# EAGLE design sem1a-vcf (EAGLE 6.6.0)
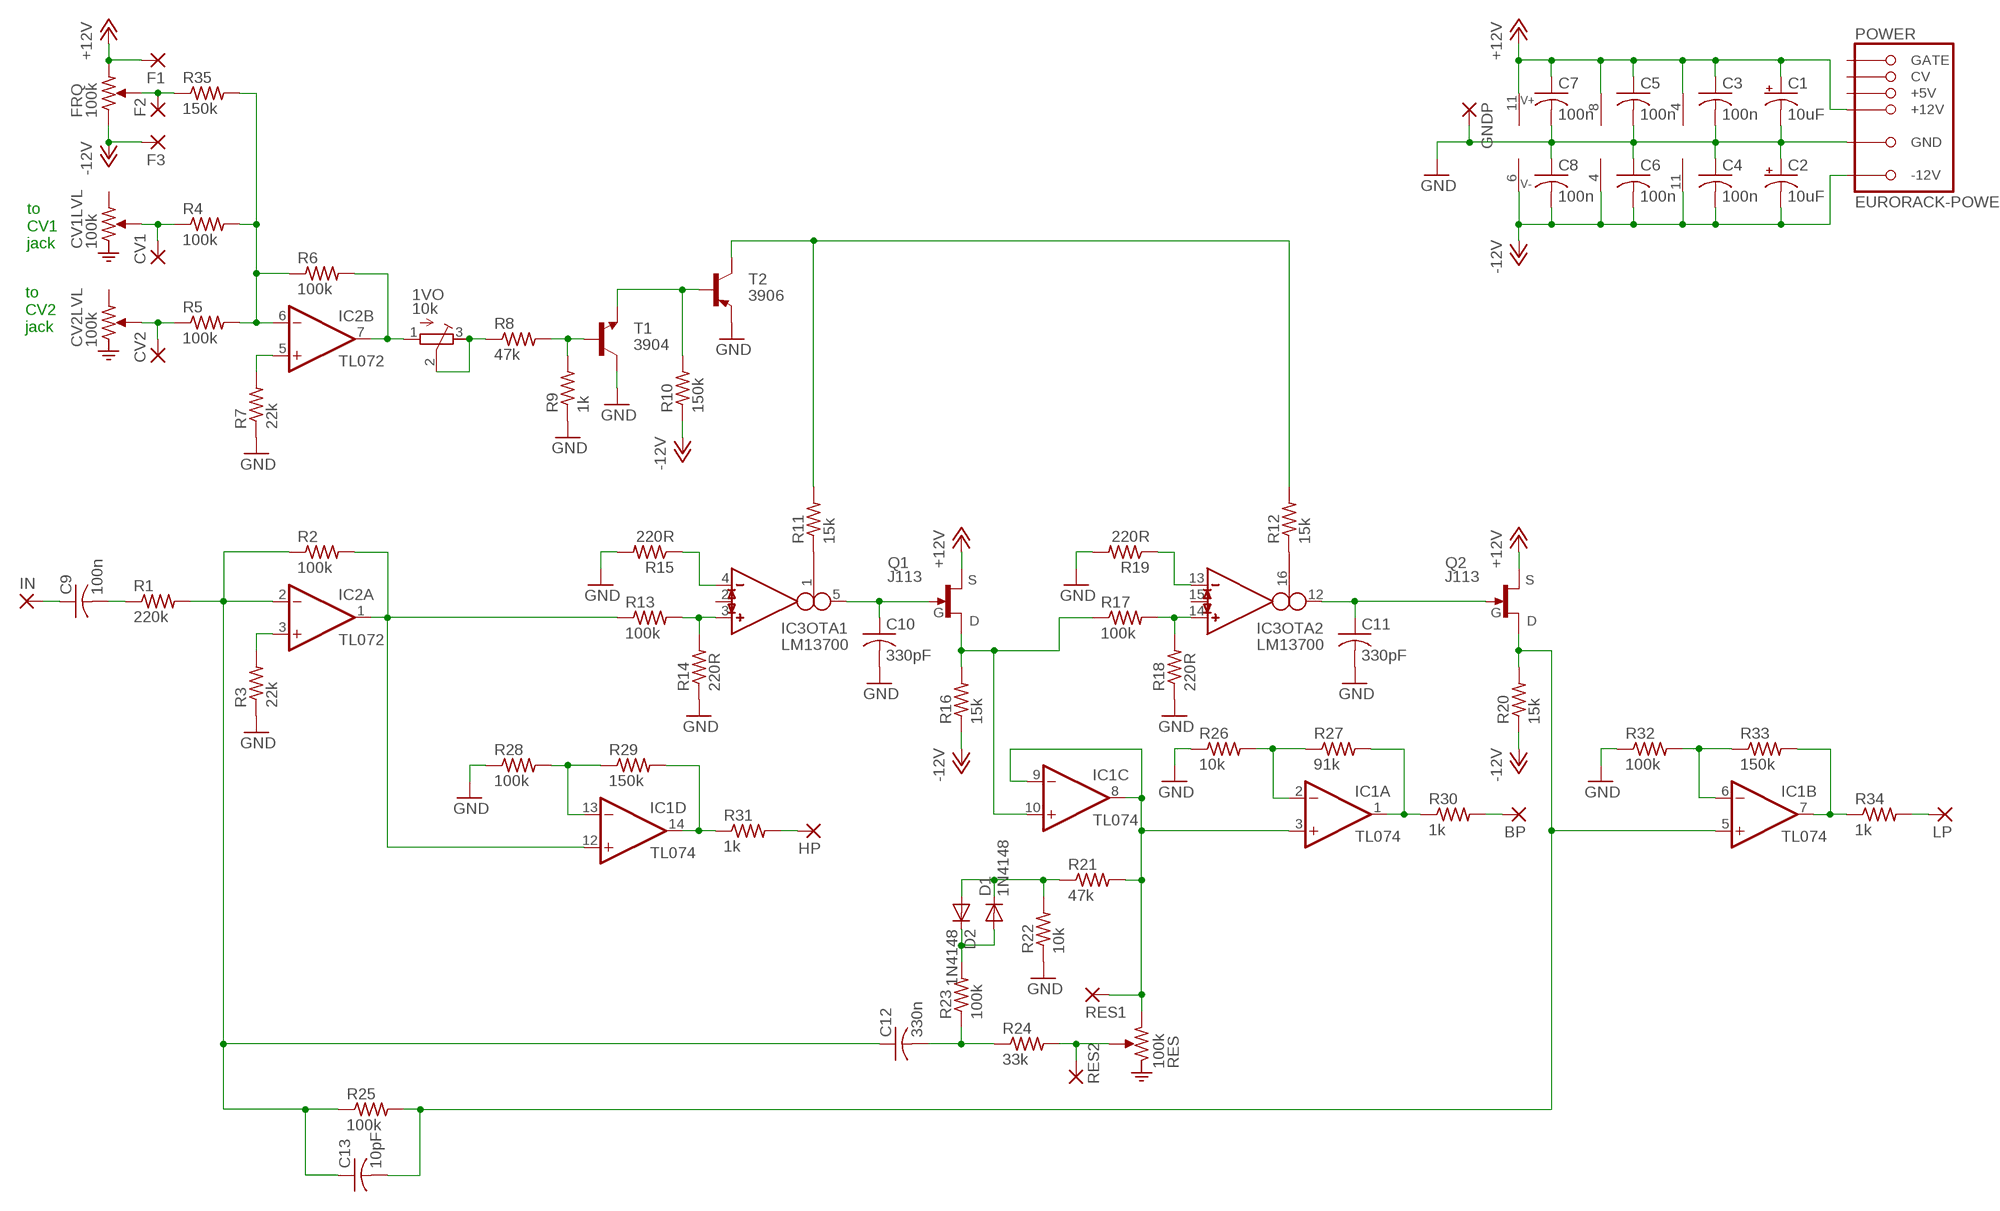
[diagram p0: schematic, sheet 1]

## Parts
1VO  10k  R-TRIMM64W  [RTRIM64W]
BP  2,54/1,0  [2,54/1,0]
C1  10uF  CPOL-USE2.5-5  [E2,5-5]
C2  10uF  CPOL-USE2.5-5  [E2,5-5]
C3  100n  C-US025-025X050  [C025-025X050]
C4  100n  C-US025-025X050  [C025-025X050]
C5  100n  C-US025-025X050  [C025-025X050]
C6  100n  C-US025-025X050  [C025-025X050]
C7  100n  C-US025-025X050  [C025-025X050]
C8  100n  C-US025-025X050  [C025-025X050]
C9  100n  C-US050-025X075  [C050-025X075]
C10  330pF  C-US050-025X075  [C050-025X075]
C11  330pF  C-US050-025X075  [C050-025X075]
C12  330n  C-US050-025X075  [C050-025X075]
C13  10pF  C-US050-025X075  [C050-025X075]
CV1  2,54/1,0  [2,54/1,0]
CV1LVL  100k  POT-ATTEN  (no package)
CV2  2,54/1,0  [2,54/1,0]
CV2LVL  100k  POT-ATTEN  (no package)
D1  1N4148  1N4148DO35-7  [DO35-7]
D2  1N4148  1N4148DO35-7  [DO35-7]
F1  2,54/1,0  [2,54/1,0]
F2  2,54/1,0  [2,54/1,0]
F3  2,54/1,0  [2,54/1,0]
FRQ  100k  POT  (no package)
GNDP  2,54/1,0  [2,54/1,0]
HP  2,54/1,0  [2,54/1,0]
IC1  TL074  TL074-TOPP  [DIL14]
IC2  TL072  TL072-TOPP  [DIL08]
IC3  LM13700  LM13700-TOPDIP16  [DIL16]
IN  2,54/1,0  [2,54/1,0]
LP  2,54/1,0  [2,54/1,0]
POWER  EURORACK-POWER  [PINSHRD_PTH_2X8]
Q1  J113  2N5457  [TO92-EBC]
Q2  J113  2N5457  [TO92-EBC]
R1  220k  R-US_0207/10  [0207/10]
R2  100k  R-US_0207/2V  [0207/2V]
R3  22k  R-US_0207/10  [0207/10]
R4  100k  R-US_0207/10  [0207/10]
R5  100k  R-US_0207/10  [0207/10]
R6  100k  R-US_0207/2V  [0207/2V]
R7  22k  R-US_0207/10  [0207/10]
R8  47k  R-US_0207/10  [0207/10]
R9  1k  R-US_0207/10  [0207/10]
R10  150k  R-US_0207/10  [0207/10]
R11  15k  R-US_0207/10  [0207/10]
R12  15k  R-US_0207/10  [0207/10]
R13  100k  R-US_0207/10  [0207/10]
R14  220R  R-US_0207/10  [0207/10]
R15  220R  R-US_0207/10  [0207/10]
R16  15k  R-US_0207/10  [0207/10]
R17  100k  R-US_0207/10  [0207/10]
R18  220R  R-US_0207/10  [0207/10]
R19  220R  R-US_0207/10  [0207/10]
R20  15k  R-US_0207/10  [0207/10]
R21  47k  R-US_0207/10  [0207/10]
R22  10k  R-US_0207/10  [0207/10]
R23  100k  R-US_0207/10  [0207/10]
R24  33k  R-US_0207/10  [0207/10]
R25  100k  R-US_0207/10  [0207/10]
R26  10k  R-US_0207/10  [0207/10]
R27  91k  R-US_0207/2V  [0207/2V]
R28  100k  R-US_0207/10  [0207/10]
R29  150k  R-US_0207/2V  [0207/2V]
R30  1k  R-US_0207/10  [0207/10]
R31  1k  R-US_0207/10  [0207/10]
R32  100k  R-US_0207/10  [0207/10]
R33  150k  R-US_0207/2V  [0207/2V]
R34  1k  R-US_0207/10  [0207/10]
R35  150k  R-US_0207/10  [0207/10]
RES  100k  POT-ATTEN  (no package)
RES1  2,54/1,0  [2,54/1,0]
RES2  2,54/1,0  [2,54/1,0]
T1  3904  -NPN-TO92-EBC  [TO92-EBC]
T2  3906  -PNP-TO92-EBC  [TO92-EBC]

## Nets
+12V: C1.+ C3.1 C5.1 C7.1 F1.1(P) FRQ.1 IC1.4(P:V+) IC2.8(P:V+) IC3.11 POWER.+12V@1(+12V) POWER.+12V@2(+12V) Q1.E(S) Q2.E(S)
-12V: C2.- C4.2 C6.2 C8.2 F3.1(P) FRQ.3 IC1.11(P:V-) IC2.4(P:V-) IC3.6 POWER.-12V@1(-12V) POWER.-12V@2(-12V) R10.1 R16.1 R20.1
GND: C1.- C2.+ C3.2 C4.1 C5.2 C6.1 C7.2 C8.1 C10.2 C11.2 GNDP.1(P) POWER.GND@1(GND) POWER.GND@2(GND) POWER.GND@3(GND) POWER.GND@4(GND) POWER.GND@5(GND) POWER.GND@6(GND) R3.1 R7.1 R9.1 R14.1 R15.2 R18.1 R19.2 R22.1 R26.1 R28.1 R32.1 T1.C T2.E
N$1: CV1.1(P) CV1LVL.2 R4.1
N$2: CV2.1(P) CV2LVL.2 R5.1
N$3: IC2.6(B:-IN) R4.2 R5.2 R6.1 R35.2
N$4: 1VO.2(S) 1VO.3(E) R8.1
N$5: R10.2 T1.E T2.B
N$6: IC1.3(A:+IN) IC1.8(C:OUT) IC1.9(C:-IN) R21.2 RES1.1(P) RES.1
N$7: R24.2 RES2.1(P) RES.2
N$8: R8.2 R9.2 T1.B
N$9: IC3.1(OTA1:I_BIAS) R11.1
N$10: C9.1 IN.1(P)
N$11: C9.2 R1.1
N$12: C12.1 C13.1 IC2.2(A:-IN) R1.2 R2.1 R25.1
N$13: IC1.12(D:+IN) IC2.1(A:OUT) R2.2 R13.1
N$14: IC2.3(A:+IN) R3.2
N$15: IC3.16(OTA2:I_BIAS) R12.1
N$16: 1VO.1(A) IC2.7(B:OUT) R6.2
N$17: IC2.5(B:+IN) R7.2
N$18: IC3.3(OTA1:IN_P) R13.2 R14.2
N$19: IC3.4(OTA1:IN_N) R15.1
N$20: C10.1 IC3.5(OTA1:OUT) Q1.C(G)
N$21: IC1.10(C:+IN) Q1.B(D) R16.2 R17.1
N$22: IC3.13(OTA2:IN_N) R19.1
N$23: IC3.14(OTA2:IN_P) R17.2 R18.2
N$24: C11.1 IC3.12(OTA2:OUT) Q2.C(G)
N$25: IC1.2(A:-IN) R26.2 R27.1
N$26: D1.C D2.A R21.1 R22.2
N$27: D1.A D2.C R23.2
N$28: R11.2 R12.2 T2.C
N$29: C12.2 R23.1 R24.1
N$30: C13.2 IC1.5(B:+IN) Q2.B(D) R20.2 R25.2
N$31: IC1.1(A:OUT) R27.2 R30.1
N$32: IC1.13(D:-IN) R28.2 R29.1
N$33: IC1.14(D:OUT) R29.2 R31.1
N$34: BP.1(P) R30.2
N$35: HP.1(P) R31.2
N$36: IC1.6(B:-IN) R32.2 R33.1
N$37: IC1.7(B:OUT) R33.2 R34.1
N$38: LP.1(P) R34.2
N$39: F2.1(P) FRQ.2 R35.1
Unconnected: CV1LVL.1 CV2LVL.1 IC3.2(OTA1:I_DIODE) IC3.7(BUF1:B) IC3.8(BUF1:E) IC3.9(BUF2:E) IC3.10(BUF2:B) IC3.15(OTA2:I_DIODE) POWER.+5V@1(+5V) POWER.+5V@2(+5V) POWER.CV@1(CV) POWER.CV@2(CV) POWER.GATE@1(GATE) POWER.GATE@2(GATE)

## Notes on the sheet
- to
  CV1
  jack
- to
  CV2
  jack

## Library data of the parts
1VO = rcl:R-TRIMM: Trimm resistor
BP CV1 CV2 F1-F3 GNDP HP IN LP RES1 RES2 = wirepad:2,54/1,0: THROUGH-HOLE PAD
C1 C2 = rcl:CPOL-US: POLARIZED CAPACITOR, American symbol
C3-C13 = rcl:C-US: CAPACITOR, American symbol
CV1LVL CV2LVL RES = mmoretti:POT-ATTEN
D1 D2 = diode:1N4148: DIODE high speed (Philips)
FRQ = mmoretti:POT
IC1 = mmoretti:TL074-TOP: OP AMP
IC2 = mmoretti:TL072-TOP: OP AMP
IC3 = mmoretti:LM13700-TOP
POWER = mmoretti:EURORACK-POWER
Q1 Q2 = mmoretti:2N5457
R1-R35 = rcl:R-US_: RESISTOR, American symbol
T1 = transistor-neu-to92:*-NPN-: NPN Transistror
T2 = transistor-neu-to92:*-PNP-: PNP Transistror

## Board
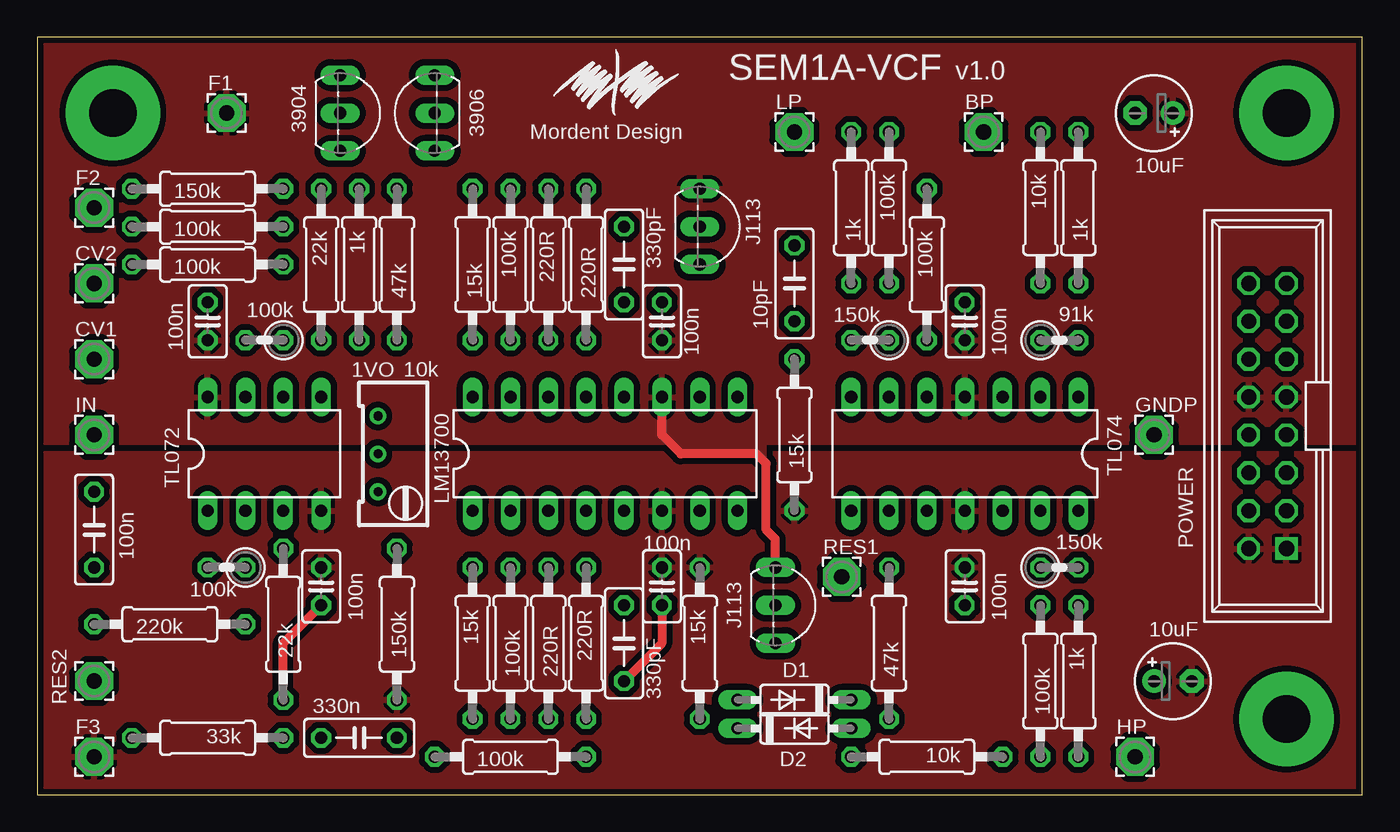
[diagram p1: board, top side]
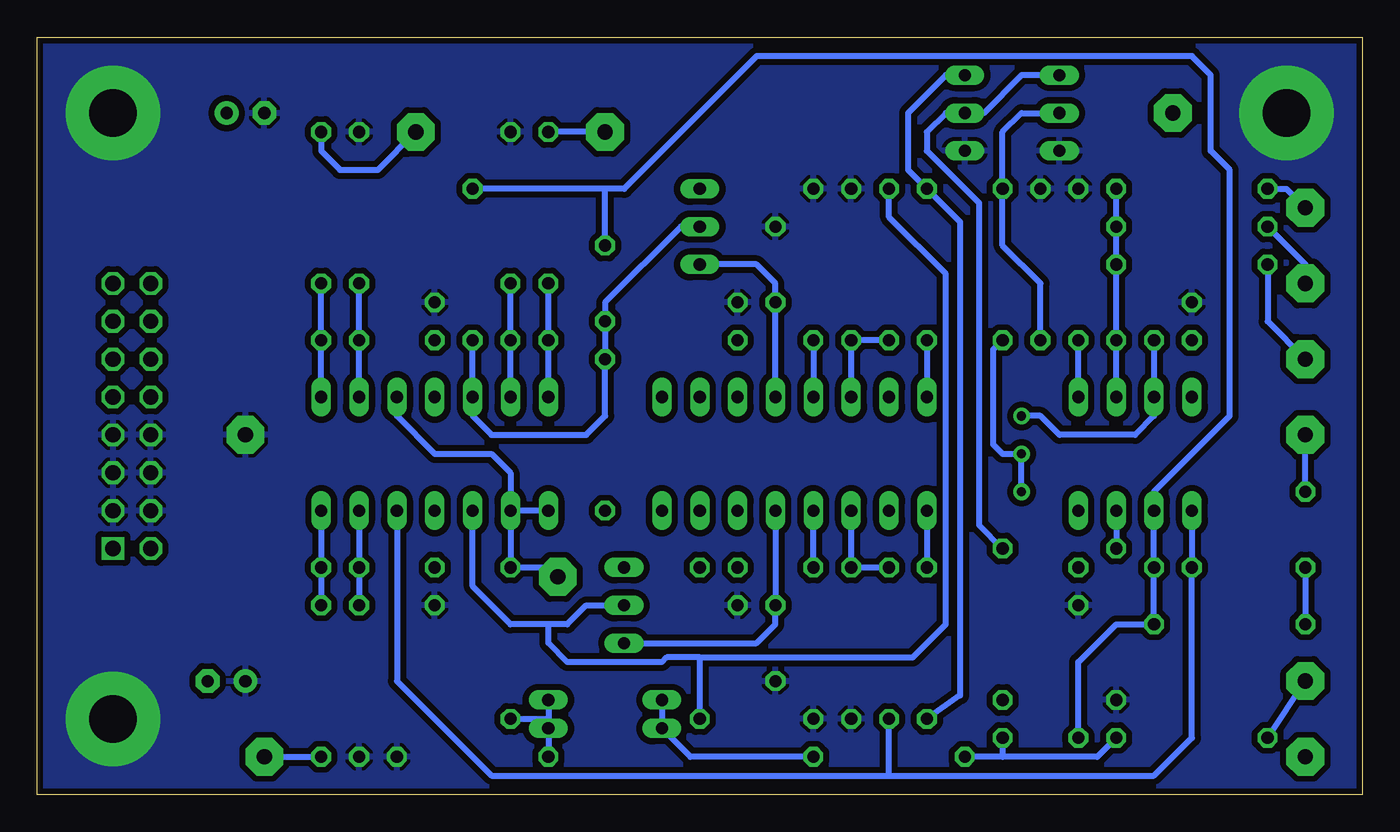
[diagram p2: board, bottom side, seen from below]

Size 88.9 x 50.8 mm. Coordinates in mm from the lower left corner, seen from the top.
Outline: 0,0 88.9,0 88.9,50.8 0,50.8 0,0
Copper layers (1*16): Top 0.035mm / dielectric 1.5mm / Bottom 0.035mm
Design rules "SeeedStudio_2layer_DRU_no_angle_20140221": minimum track width 6mil, minimum drill 12mil, track to track 6mil, track to pad 6mil, pad to pad 6mil, via to via 6mil, smd to smd 0mil, copper to edge 10mil, drill to drill 10mil, minimum pad ring 10mil, minimum via ring 6mil, stop-mask expansion 2mil, vias tented up to drill 100mil, thermal gap 10mil

### Footprints (pad centres in the part's own frame; a part is rotated, then mirrored left to right if it is on the bottom)
RTRIM64W = drill 0.61: 1 1.27,-2.54; 2 1.27,0; 3 1.27,2.54
2,54/1,0 = drill 1.016 pad 2.54 octagon: 1 0,0
E2,5-5 = drill 0.813 pad 1.6: + -1.27,0 | drill 0.813 pad 1.6 octagon: - 1.27,0
C025-025X050 = drill 0.813 octagon: 1 -1.27,0; 2 1.27,0
C050-025X075 = drill 0.813 octagon: 1 -2.54,0; 2 2.54,0
DO35-7 = drill 0.813 long: A 3.81,0; C -3.81,0
DIL14 = drill 0.813 long: 1 -7.62,-3.81; 2 -5.08,-3.81; 3 -2.54,-3.81; 4 0,-3.81; 5 2.54,-3.81; 6 5.08,-3.81; 7 7.62,-3.81; 8 7.62,3.81; 9 5.08,3.81; 10 2.54,3.81; 11 0,3.81; 12 -2.54,3.81; 13 -5.08,3.81; 14 -7.62,3.81
DIL08 = drill 0.813 long: 1 -3.81,-3.81; 2 -1.27,-3.81; 3 1.27,-3.81; 4 3.81,-3.81; 5 3.81,3.81; 6 1.27,3.81; 7 -1.27,3.81; 8 -3.81,3.81
DIL16 = drill 0.813 long: 1 -8.89,-3.81; 2 -6.35,-3.81; 3 -3.81,-3.81; 4 -1.27,-3.81; 5 1.27,-3.81; 6 3.81,-3.81; 7 6.35,-3.81; 8 8.89,-3.81; 9 8.89,3.81; 10 6.35,3.81; 11 3.81,3.81; 12 1.27,3.81; 13 -1.27,3.81; 14 -3.81,3.81; 15 -6.35,3.81; 16 -8.89,3.81
PINSHRD_PTH_2X8 = drill 1.016 octagon: +5V@1 3.81,1.27; +5V@2 3.81,-1.27; +12V@1 1.27,1.27; +12V@2 1.27,-1.27; -12V@1 -8.89,1.27; CV@1 6.35,1.27; CV@2 6.35,-1.27; GATE@1 8.89,1.27; GATE@2 8.89,-1.27; GND@1 -6.35,1.27; GND@2 -6.35,-1.27; GND@3 -3.81,1.27; GND@4 -3.81,-1.27; GND@5 -1.27,1.27; GND@6 -1.27,-1.27 | drill 1.016 square: -12V@2 -8.89,-1.27
TO92-EBC = drill 0.813 long: B 0,-1.27; C 2.54,-1.27; E -2.54,-1.27
0207/10 = drill 0.813 octagon: 1 -5.08,0; 2 5.08,0
0207/2V = drill 0.813 octagon: 1 -1.27,0; 2 1.27,0

### Placement (x,y rotation side)
1VO  24.13,22.86 180 top
BP  63.5,44.45 0 top
C1  74.93,45.72 180 top
C2  76.2,7.62 0 top
C3  62.23,31.75 90 top
C4  62.23,13.97 90 top
C5  41.91,31.75 90 top
C6  41.91,13.97 90 top
C7  11.43,31.75 90 top
C8  19.05,13.97 90 top
C9  3.81,17.78 270 top
C10  39.37,10.16 270 top
C11  39.37,35.56 90 top
C12  21.59,3.81 0 top
C13  50.8,34.29 270 top
CV1  3.81,29.21 0 top
CV2  3.81,34.29 0 top
D1  50.8,6.35 180 top
D2  50.8,4.45 0 top
F1  12.7,45.72 0 top
F2  3.81,39.37 0 top
F3  3.81,2.54 0 top
GNDP  74.93,24.13 0 top
HP  73.66,2.54 0 top
IC1  62.23,22.86 180 top
IC2  15.24,22.86 0 top
IC3  38.1,22.86 0 top
IN  3.81,24.13 0 top
LP  50.8,44.45 0 top
POWER  82.55,25.4 90 top
Q1  50.8,12.7 270 top
Q2  45.72,38.1 270 top
R1  8.89,11.43 0 top
R2  12.7,15.24 180 top
R3  16.51,11.43 90 top
R4  11.43,35.56 0 top
R5  11.43,38.1 0 top
R6  15.24,30.48 180 top
R7  19.05,35.56 270 top
R8  24.13,35.56 90 top
R9  21.59,35.56 270 top
R10  24.13,11.43 90 top
R11  29.21,10.16 270 top
R12  29.21,35.56 90 top
R13  31.75,10.16 90 top
R14  34.29,10.16 90 top
R15  36.83,10.16 270 top
R16  44.45,10.16 270 top
R17  31.75,35.56 270 top
R18  34.29,35.56 270 top
R19  36.83,35.56 90 top
R20  50.8,24.13 90 top
R21  57.15,10.16 90 top
R22  59.69,2.54 180 top
R23  31.75,2.54 0 top
R24  11.43,3.81 180 top
R25  59.69,35.56 270 top
R26  67.31,39.37 270 top
R27  68.58,30.48 0 top
R28  67.31,7.62 90 top
R29  68.58,15.24 0 top
R30  69.85,39.37 90 top
R31  69.85,7.62 270 top
R32  57.15,39.37 270 top
R33  55.88,30.48 180 top
R34  54.61,39.37 90 top
R35  11.43,40.64 0 top
RES1  53.98,14.61 0 top
RES2  3.81,7.62 0 top
T1  21.59,45.72 270 top
T2  25.4,45.72 90 top

### Tracks (layer width: path | path; a pad name or v marks a point on that pad's centre or on a via)
+12V
  Top 0.61: Q1.E 49.53,17.14 48.9,17.78 48.9,22.23 48.26,22.86 43.18,22.86 41.91,24.13 IC3.11
  pour Top (isolate 0.406, rank 2): 0,50.8 0,22.86 88.9,22.86 88.9,50.8
-12V
  pour Top (isolate 0.406): 0,0 0,22.86 88.9,22.86 88.9,0
GND  (via drill 3.17 pad 6.35)
  Top 0.61: R3.1 16.51,10.16 C8.1 | C6.1 41.91,10.16 C10.2
  other vias: 83.82,5.08 83.82,45.72 5.08,45.72
  pour Bottom (isolate 0.406): 0,50.8 88.9,50.8 88.9,0 0,0
N$1
  Bottom 0.406: R4.1 6.35,31.75 CV1.1
N$2
  Bottom 0.406: R5.1 3.81,35.56 CV2.1
N$3
  Bottom 0.406: IC2.6 R6.1 R4.2 R5.2 R35.2
N$4
  Bottom 0.406: 1VO.3 1VO.2 24.13,22.86 24.77,23.5 24.77,29.84 R8.1
N$5
  Bottom 0.406: T1.E 22.86,48.26 25.4,45.72 T2.B 27.94,45.72 29.21,44.45 29.21,43.18 25.72,39.69 25.72,18.1 R10.2
N$6
  Bottom 0.406: IC1.3 64.77,25.4 62.23,22.86 58.42,22.86 57.15,21.59 IC1.9 | IC1.8 IC1.9 | IC1.9 R21.2 54.61,15.24 RES1.1
N$7
  Bottom 0.406: R24.2 RES2.1
N$8
  Bottom 0.406: R9.2 21.59,34.29 24.13,36.83 R8.2 24.13,44.45 22.86,45.72 T1.B
N$9
  Bottom 0.406: IC3.1 R11.1
N$10
  Bottom 0.406: C9.1 IN.1
N$11
  Bottom 0.406: C9.2 R1.1
N$12
  Bottom 0.406: C12.1 19.05,8.89 16.51,11.43 R1.2 R2.1 IC2.2 13.97,20.32 8.89,25.4 8.89,41.91 10.16,43.18 10.16,48.26 11.43,49.53 40.64,49.53 49.53,40.64 50.8,40.64 | 50.8,40.64 R25.1 | C13.1 50.8,40.64
N$13
  Bottom 0.406: IC2.1 R2.2 11.43,3.81 13.97,1.27 31.75,1.27 | IC1.12 64.77,7.62 58.42,1.27 31.75,1.27 | 31.75,1.27 R13.1
N$14
  Bottom 0.406: IC2.3 R3.2
N$15
  Bottom 0.406: R12.1 IC3.16
N$16
  Bottom 0.406: R6.2 IC2.7 13.97,25.4 15.24,24.13 20.32,24.13 21.59,25.4 1VO.1
N$17
  Bottom 0.406: IC2.5 R7.2
N$18
  Bottom 0.406: IC3.3 R14.2 R13.2
N$19
  Bottom 0.406: R15.1 IC3.4
N$20
  Bottom 0.406: IC3.5 C10.1 39.37,11.43 40.64,10.16 Q1.C
N$21
  Bottom 0.406: R16.2 44.45,9.21 | 54.61,11.43 53.34,11.43 52.07,12.7 Q1.B | 54.61,11.43 57.15,11.43 59.69,13.97 IC1.10 | 44.45,9.21 30.16,9.21 27.94,11.43 27.94,34.92 31.75,38.73 R17.1 | 44.45,9.21 46.67,9.21 46.99,8.89 53.34,8.89 54.61,10.16 54.61,11.43
N$22
  Bottom 0.406: R19.1 IC3.13
N$23
  Bottom 0.406: R17.2 R18.2 IC3.14
N$24
  Bottom 0.406: IC3.12 C11.1 39.37,34.29 40.64,35.56 Q2.C
N$25
  Bottom 0.406: IC1.2 R27.1 R26.2
N$26
  Bottom 0.406: D1.C 54.61,5.08 | 54.61,5.08 D2.A R22.2 | R21.1 54.61,5.08
N$27
  Bottom 0.406: D1.A D2.C 45.09,2.54 R23.2
N$28
  Bottom 0.406: R11.2 26.99,6.67 26.99,38.42 R12.2 30.48,41.91 30.48,45.72 27.94,48.26 T2.C
N$29
  Bottom 0.406: R24.1 17.78,2.54 24.13,2.54 | 24.13,2.54 R23.1 | C12.2 24.13,2.54
N$30
  Bottom 0.406: Q2.B 45.72,38.1 50.8,33.02 C13.2 R20.2 50.8,25.4 52.07,24.13 58.42,24.13 59.69,25.4 IC1.5 R25.2
N$31
  Bottom 0.406: IC1.1 R27.2 R30.1
N$32
  Bottom 0.406: IC1.13 R29.1 R28.2
N$33
  Bottom 0.406: IC1.14 R29.2 R31.1
N$34
  Bottom 0.406: R30.2 69.85,43.18 68.58,41.91 66.04,41.91 BP.1
N$35
  Bottom 0.406: HP.1 R31.2
N$36
  Bottom 0.406: IC1.6 R33.1 R32.2
N$37
  Bottom 0.406: IC1.7 R33.2 R34.1
N$38
  Bottom 0.406: LP.1 R34.2
N$39
  Bottom 0.406: R35.1 5.08,40.64 F2.1

### Text on the board
tPlace: SEM1A-VCF | v1.0 | Mordent Design